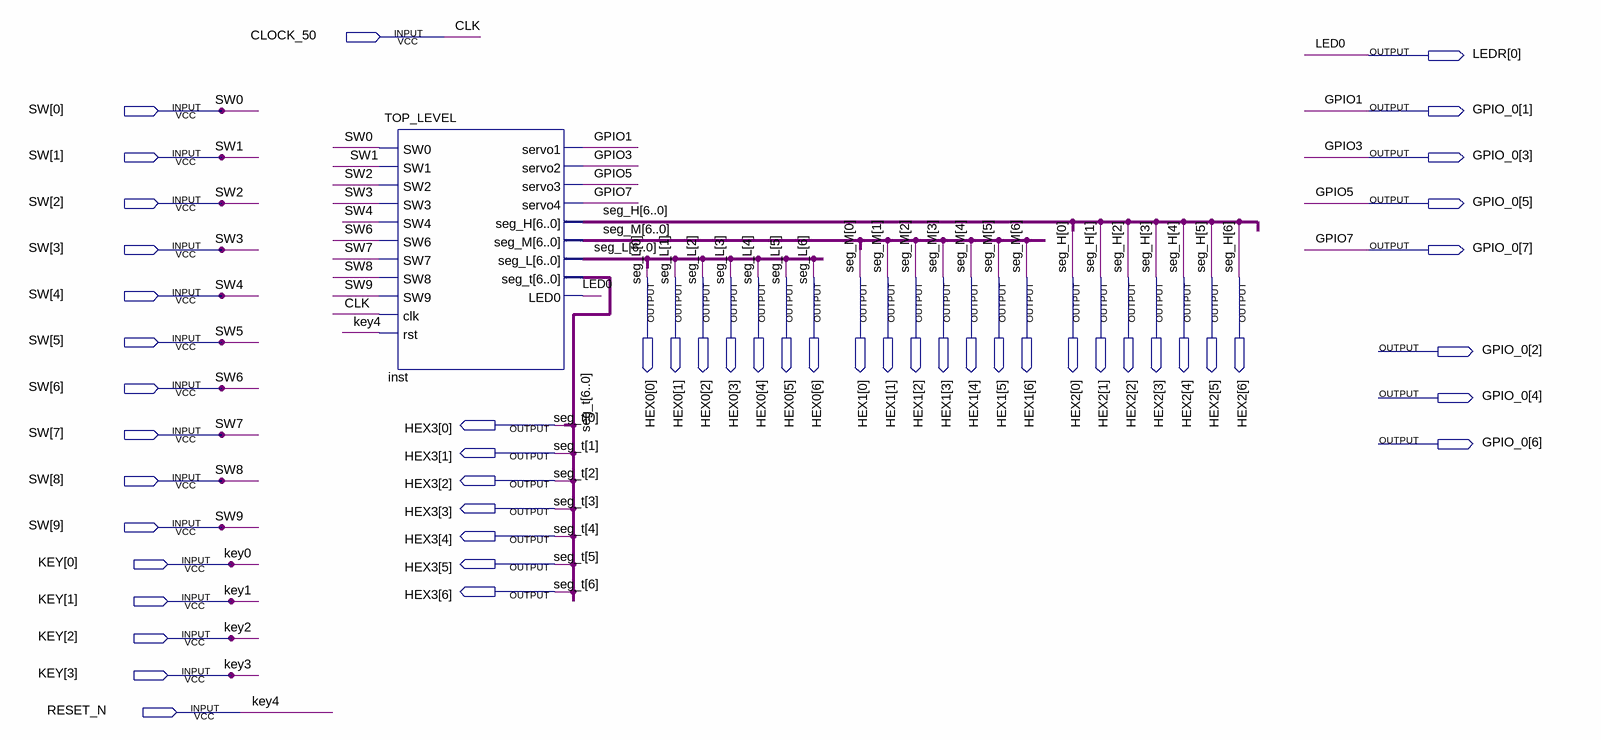
[diagram p0: schematic sheet]
// Quartus schematic Top.bdf as structural Verilog: 1 symbols, 52 pins
module Top (
  input  CLOCK_50,
  input  [9:0] SW,
  input  [3:0] KEY,
  input  RESET_N,
  output [0:0] LEDR,
  output [7:1] GPIO_0,
  output [6:0] HEX0,
  output [6:0] HEX1,
  output [6:0] HEX2,
  output [6:0] HEX3
);

  TOP_LEVEL inst (
    .SW0(SW[0]), .SW1(SW[1]), .SW2(SW[2]), .SW3(SW[3]), .SW4(SW[4]), .SW6(SW[6]), .SW7(SW[7]), .SW8(SW[8]),
    .SW9(SW[9]), .clk(CLOCK_50), .rst(RESET_N), .servo1(GPIO_0[1]), .servo2(GPIO_0[3]), .servo3(GPIO_0[5]),
    .servo4(GPIO_0[7]), .seg_H(HEX2), .seg_M(HEX1), .seg_L(HEX0), .seg_t(HEX3), .LED0(LEDR[0]));

  // Other names for the same wires on the sheet: CLK = CLOCK_50; GPIO1 = GPIO_0[1]; GPIO3 = GPIO_0[3];
  //   GPIO5 = GPIO_0[5]; GPIO7 = GPIO_0[7]; key4 = RESET_N; LED0 = LEDR[0]; seg_H[6:0] = HEX2; seg_L[6:0] = HEX0;
  //   seg_M[6:0] = HEX1; seg_t[6:0] = HEX3
endmodule
